# Altium project Cooling Fan Control.PrjPcb
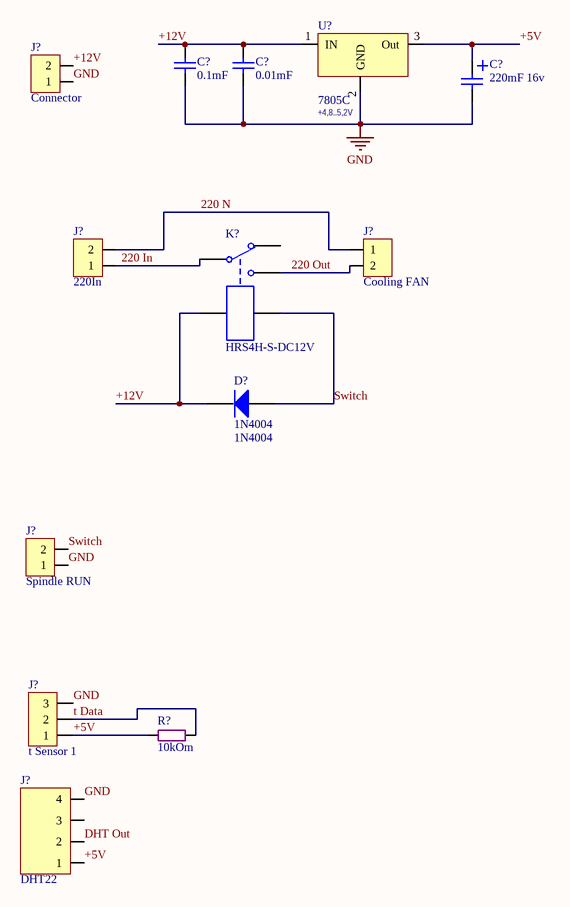
[diagram p0: Cooling Fan Control.SchDoc]
1 sheet, 13 parts. Net scope: global (net labels, ports and power ports of the same name join across sheets).
Board file: Cooling Fan Control.PcbDoc

## Sheet Cooling Fan Control.SchDoc
size A4

### Parts
(Parts that share a designator on the sheet are numbered #1, #2 ... from top to bottom, then left to right.)
C?#1  0.1mF  [Cap p2.54mm (2p)]
C?#2  0.01mF  [Cap p2.54mm (2p)]
C?#3  220mF 16v  [Cap E p2mm D6.5xH11]
D?  1N4004  [Diode DO-35]
J?#1  Connector  [DG301 5mm 2p]
J?#2  Cooling FAN  [DG301 5mm 2p]
J?#3  220In  [DG301 5mm 2p]
J?#4  Spindle RUN  [DG301 5mm 2p]
J?#5  t Sensor 1  [DG301 5mm 3p]
J?#6  DHT22  [Line 2.54 X 4]
K?  HRS4H-S-DC12V  [Relay Type C]
R?  10kOm  [SMD 0805 (2012)]
U?  7805C  V Out: +4,8..5,2V  [D-PAK]

### Nets
GND: C?#1.2 C?#2.2 C?#3.2 J?#1.1 J?#4.1 J?#5.3 J?#6.4 U?.2(GND)
220 In: J?#3.1 K?.2
220 N: J?#2.1 J?#3.2
220 Out: J?#2.2 K?.3
+5V: C?#3.1 J?#5.1 J?#6.1 R?.1 U?.3(Out)
+12V: C?#1.1 C?#2.1 D?.K J?#1.2 K?.4 U?.1(IN)
DHT Out: J?#6.2
Switch: D?.A J?#4.2 K?.5
t Data: J?#5.2 R?.2

Not connected (* = marked no-connect by the designer): J?#6 3; K? 1

### Library data of the parts
C?#1 C?#2 = Cap Ceramic: Capacitor
C?#3 = Cap E 220mF x 16V: Capacitor; Value: 220mF 16v
D? = Diode 1N4004: 1 Amp General Purpose Rectifier; PackageReference: DO-41; PackageDescription: Diode, Axial; Body 5.2 x 2.7 mm (LxDia. max), Lead Dia. 0.86 mm (max); Code_JEDEC: DO-204-AL; ComponentLink1Description: Manufacturer Link; ComponentLink1URL: http://www.fairchildsemi.com/; ComponentLink2Description: Datasheet; ComponentLink2URL: http://www.fairchildsemi.com/ds/1N%2F1N4001.pdf; VALUE: 1N4004
J?#1-J?#4 = DG301-5.0-2P12: DG301 series
J?#5 = DG301-5.0-3P12: DG301 series
J?#6 = PLS-4: Vert, Sgl line, Male
K? = HRS4H-S-DC12V: Single-Pole Relay 12V 10A; R обм: 240 Om; Name: HRS4H-S-DC12V; I (DC = 28 V): 10A; I (AC = 240 V): 10A; U: 12 V
R? = Res All Types
U? = 7805C: Voltage Regulator; Manufacturer: Интеграл; I output (A): 1; Max Voltage In (V): 35; Напряжение выход-вход (dropout): >2V; t: -10..+70°C; Case: D2PAK; Shema: http://tec.org.ru/_bd/5/57349922.jpg; Name: 7805C